# EAGLE schematic plant_monitor (EAGLE 7.1.0)
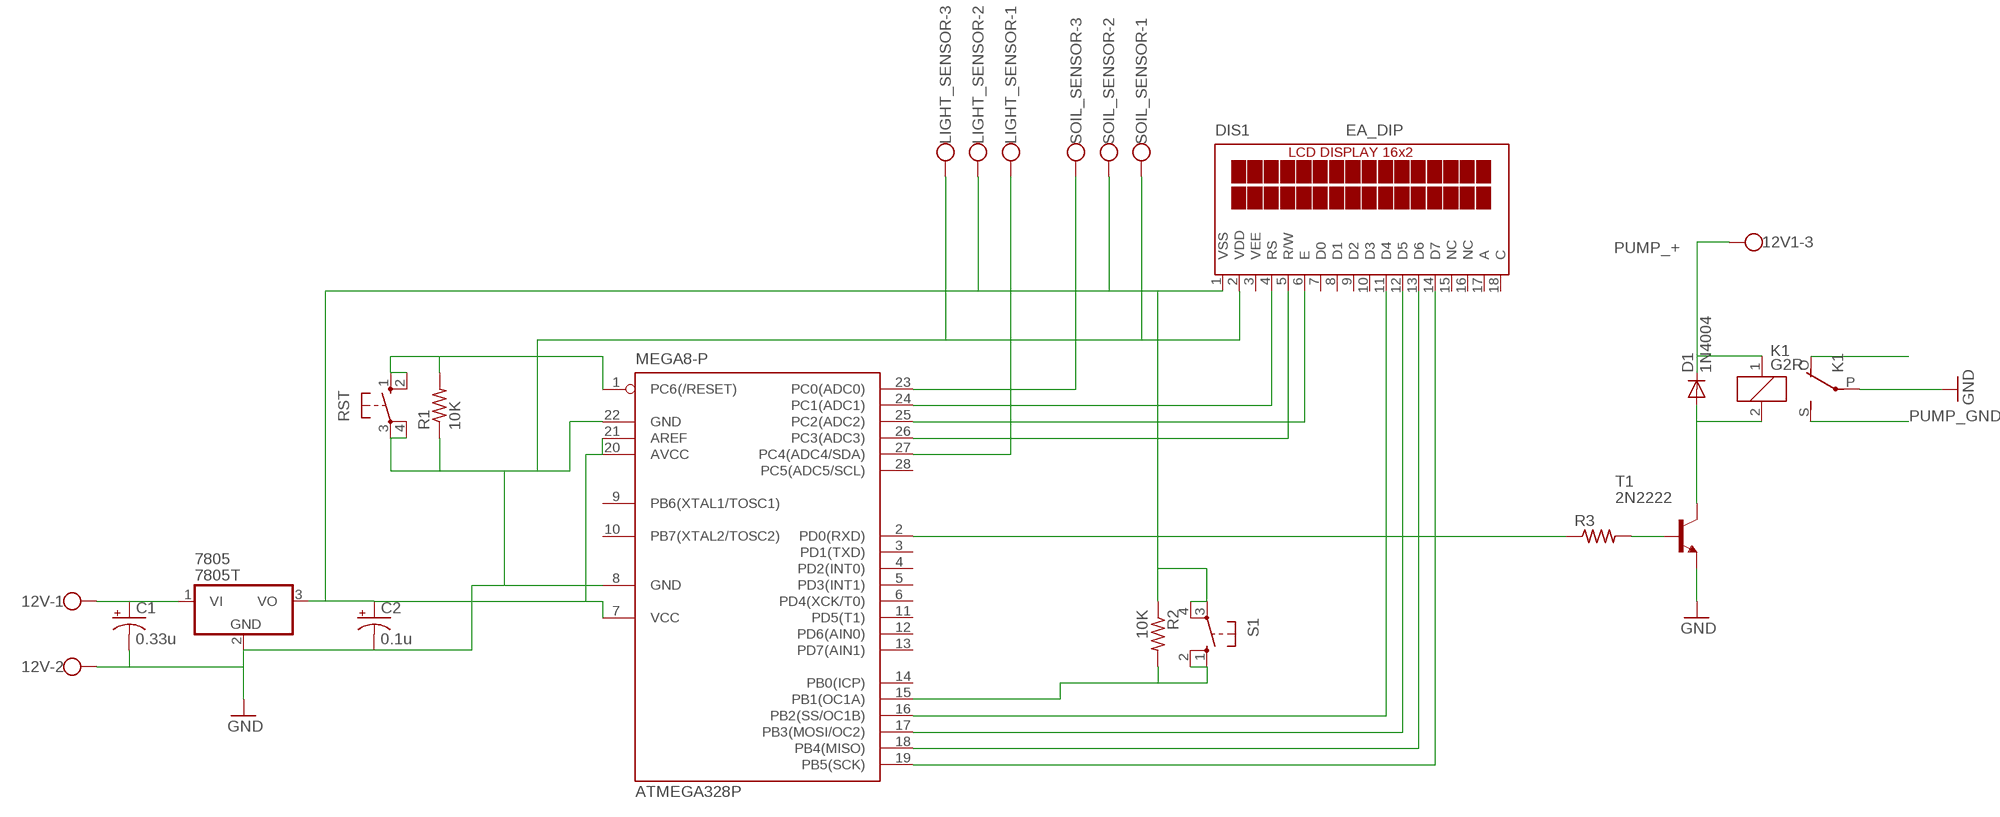
[diagram p0: schematic, sheet 1]

## Parts
12V  W237-102  [W237-102]
12V1  W237-103  [W237-103]
7805  7805T  [TO220H]
ATMEGA328P  MEGA8-P  [DIL28-3]
C1  0.33u  CPOL-USE2.5-6  [E2,5-6]
C2  0.1u  CPOL-USE2.5-6  [E2,5-6]
D1  1N4004  [DO41-10]
DIS1  EA_DIP  [EA_DIP]
K1  G2R  [G2R]
LIGHT_SENSOR  W237-103  [W237-103]
R1  10K  R-US_0207/10  [0207/10]
R2  10K  R-US_0207/10  [0207/10]
R3  R-US_0204/7  [0204/7]
RST  10-XX  [B3F-10XX]
S1  10-XX  [B3F-10XX]
SOIL_SENSOR  W237-103  [W237-103]
T1  2N2222  [TO92-EBC-OVAL]

## Nets
+5V: 7805.3(VO) ATMEGA328P.7(VCC) ATMEGA328P.20(AVCC) ATMEGA328P.21(AREF) C2.+ DIS1.1(VSS) LIGHT_SENSOR.2 R2.1 S1.3(P) S1.4(P1) SOIL_SENSOR.2
+12V: 12V.1 7805.1(VI) C1.+
B: R3.2 T1.B
C: D1.A K1.2 T1.C
DIGITAL_PIN_5: ATMEGA328P.2(PD0(RXD)) R3.1
E: K1.O(2:O) T1.E ; supply symbol labelled GND
GND: 12V.2 7805.2(GND) ATMEGA328P.8(GND) ATMEGA328P.22(GND) C1.- C2.- DIS1.2(VDD) K1.P(2:P) LIGHT_SENSOR.3 R1.1 RST.3(P) RST.4(P1) SOIL_SENSOR.1
N$1: ATMEGA328P.26(PC3(ADC3)) DIS1.5(R/W)
N$2: ATMEGA328P.25(PC2(ADC2)) DIS1.6(E)
N$3: ATMEGA328P.24(PC1(ADC1)) DIS1.4(RS)
N$4: ATMEGA328P.1(PC6(/RESET)) R1.2 RST.1(S) RST.2(S1)
N$5: ATMEGA328P.19(PB5(SCK)) DIS1.14(D7)
N$6: ATMEGA328P.18(PB4(MISO)) DIS1.13(D6)
N$7: ATMEGA328P.17(PB3(MOSI/OC2)) DIS1.12(D5)
N$8: ATMEGA328P.16(PB2(SS/OC1B)) DIS1.11(D4)
N$9: ATMEGA328P.15(PB1(OC1A)) R2.2 S1.1(S) S1.2(S1)
N$10: ATMEGA328P.23(PC0(ADC0)) SOIL_SENSOR.3
N$11: ATMEGA328P.27(PC4(ADC4/SDA)) LIGHT_SENSOR.1
PUMP_+: 12V1.3 D1.C K1.1
PUMP_GND: K1.S(2:S)
Unconnected: 12V1.1 12V1.2 ATMEGA328P.3(PD1(TXD)) ATMEGA328P.4(PD2(INT0)) ATMEGA328P.5(PD3(INT1)) ATMEGA328P.6(PD4(XCK/T0)) ATMEGA328P.9(PB6(XTAL1/TOSC1)) ATMEGA328P.10(PB7(XTAL2/TOSC2)) ATMEGA328P.11(PD5(T1)) ATMEGA328P.12(PD6(AIN0)) ATMEGA328P.13(PD7(AIN1)) ATMEGA328P.14(PB0(ICP)) ATMEGA328P.28(PC5(ADC5/SCL)) DIS1.7(D0) DIS1.8(D1) DIS1.9(D2) DIS1.10(D3) DIS1.15(NC) DIS1.16(NC) DIS1.17(A) DIS1.18(C)

## Power pins joined to a net without a drawn wire
VEE: DIS1.3(VEE)

## Library data of the parts
12V = con-wago-500:W237-102: WAGO SCREW CLAMP; MPN: 237-102; OC_FARNELL: unknown; OC_NEWARK: 70K9898
12V1 LIGHT_SENSOR SOIL_SENSOR = con-wago-500:W237-103: WAGO SCREW CLAMP; MPN: 237-103; OC_FARNELL: unknown; OC_NEWARK: 18M7116
7805 = linear:78*: Positive VOLTAGE REGULATOR Source: http://cache.national.com/ds/LM/LM78L05.pdf http://www.fairchildsemi.com/ds/LM/LM7805.pdf
ATMEGA328P = atmel:MEGA8-P: MICROCONTROLLER 8 Kbytes FLASH, 1 kbytes SRAM, 512 bytes EEPROM, USART, 4-channel 10 bit ADC, 2-channel 8 bit ADC Pin compatible with Atmega48, ATMega88, ATMega168 Source: avr.lbr; OC_FARNELL: unknown; OC_NEWARK: unknown
C1 C2 = adafruit:CPOL-US: POLARIZED CAPACITOR, American symbol
D1 = adafruit:1N4004: DIODE General purpose 1N400x type rectifier (With bigger pads) http://www.ladyada.net/library/pcb/eaglelibrary.html
DIS1 = display-lcd:EA_DIP: LCD-MODUL 2x16 - 6,68mm, INKL. KONTROLLER HD44780 Source: Data sheet <http://www.lcd-module.de/pdf/doma/dip162-d.pdf>
K1 = relay:G2R: RELAY 1 x switch, Omron; OC_FARNELL: 1569185; OC_NEWARK: unknown
R1-R3 = adafruit:R-US_: RESISTOR, American symbol
RST S1 = switch-omron:10-XX: OMRON SWITCH; MPN: B3F-1000; OC_FARNELL: 176432; OC_NEWARK: 36M3542
T1 = adafruit:2N2222: NPN TRANSISTOR Big oval pads